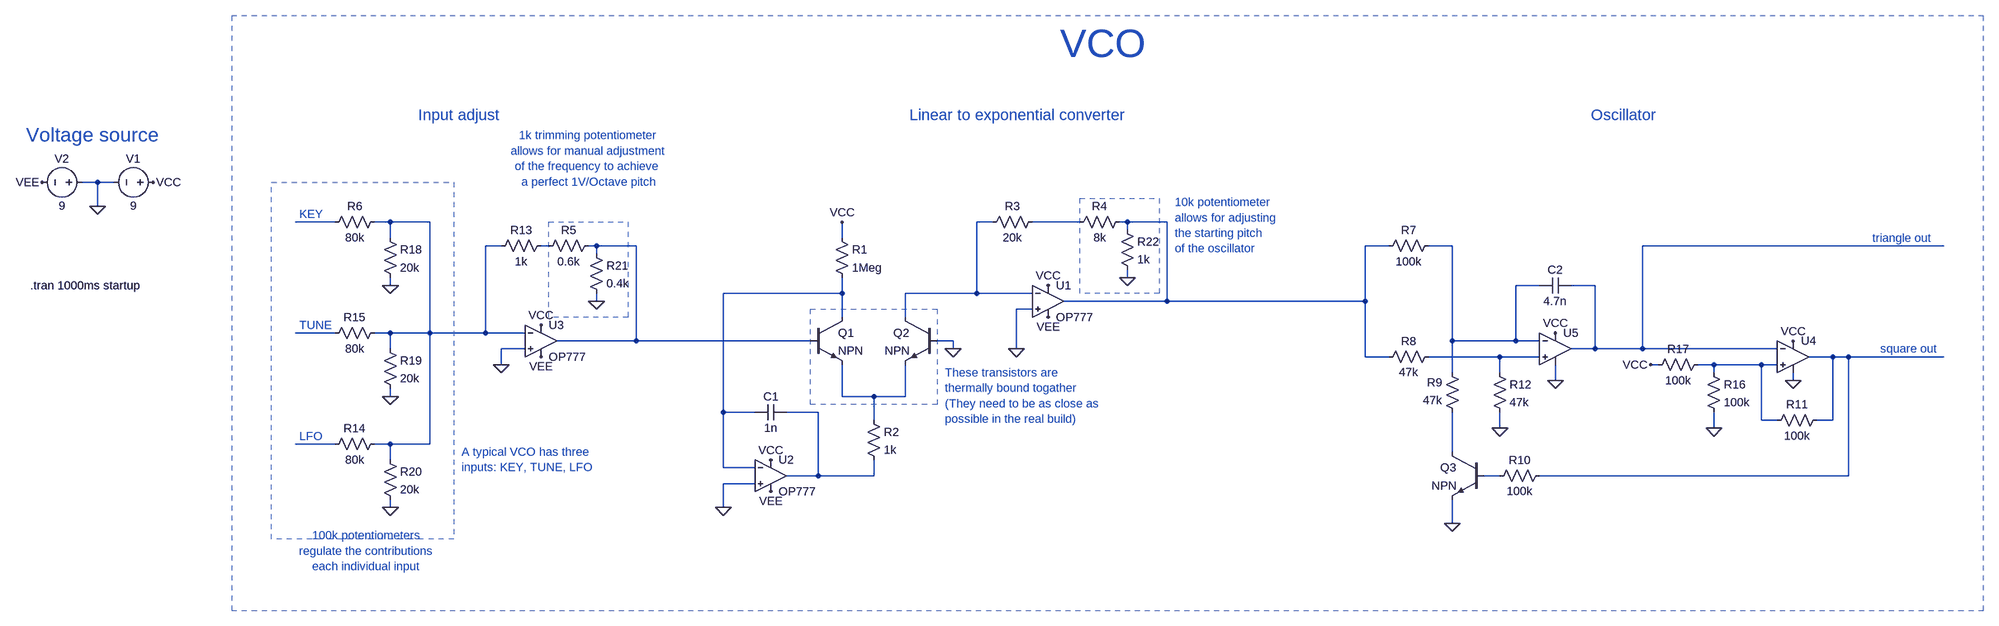
[diagram p0: schematic VCO-simulation.asc]
VCO-simulation.asc, the LTspice schematic file:
Version 4.1
SHEET 1 3220 692
WIRE -976 -176 -1008 -176
WIRE -944 -176 -976 -176
WIRE -976 -128 -976 -176
WIRE -432 -96 -512 -96
WIRE -320 -96 -352 -96
WIRE -240 -96 -320 -96
WIRE 896 -96 864 -96
WIRE 1072 -96 976 -96
WIRE 1168 -96 1152 -96
WIRE 1248 -96 1168 -96
WIRE 1168 -80 1168 -96
WIRE -320 -64 -320 -96
WIRE 592 -64 592 -96
WIRE -96 -48 -128 -48
WIRE 0 -48 -16 -48
WIRE 96 -48 80 -48
WIRE 176 -48 96 -48
WIRE 1696 -48 1648 -48
WIRE 1824 -48 1776 -48
WIRE 2816 -48 2208 -48
WIRE 96 -32 96 -48
WIRE 1168 16 1168 0
WIRE -320 32 -320 16
WIRE 2000 32 1952 32
WIRE 2112 32 2064 32
WIRE 592 48 592 16
WIRE 592 48 352 48
WIRE 864 48 864 -96
WIRE 864 48 720 48
WIRE 976 48 864 48
WIRE 96 64 96 48
WIRE 1248 64 1248 -96
WIRE 1248 64 1040 64
WIRE 1648 64 1648 -48
WIRE 1648 64 1248 64
WIRE 976 80 944 80
WIRE 592 96 592 48
WIRE 720 96 720 48
WIRE -432 128 -512 128
WIRE -320 128 -352 128
WIRE -240 128 -240 -96
WIRE -240 128 -320 128
WIRE -128 128 -128 -48
WIRE -128 128 -240 128
WIRE -48 128 -128 128
WIRE 176 144 176 -48
WIRE 176 144 16 144
WIRE 528 144 176 144
WIRE 816 144 784 144
WIRE 1824 144 1824 -48
WIRE 1952 144 1952 32
WIRE 1952 144 1824 144
WIRE 2000 144 1952 144
WIRE -320 160 -320 128
WIRE -48 160 -96 160
WIRE 816 160 816 144
WIRE 944 160 944 80
WIRE 2112 160 2112 32
WIRE 2112 160 2064 160
WIRE 2208 160 2208 -48
WIRE 2208 160 2112 160
WIRE 2480 160 2208 160
WIRE 1648 176 1648 64
WIRE 1696 176 1648 176
WIRE 1920 176 1776 176
WIRE 2000 176 1920 176
WIRE 2592 176 2544 176
WIRE 2624 176 2592 176
WIRE 2816 176 2624 176
WIRE -96 192 -96 160
WIRE 2240 192 2224 192
WIRE 2352 192 2320 192
WIRE 2448 192 2352 192
WIRE 2480 192 2448 192
WIRE 1824 208 1824 144
WIRE 1920 208 1920 176
WIRE 2352 208 2352 192
WIRE 2032 224 2032 192
WIRE 2512 224 2512 208
WIRE -320 256 -320 240
WIRE 592 256 592 192
WIRE 656 256 592 256
WIRE 720 256 720 192
WIRE 720 256 656 256
WIRE 352 288 352 48
WIRE 416 288 352 288
WIRE 544 288 480 288
WIRE 656 304 656 256
WIRE 2448 304 2448 192
WIRE 2480 304 2448 304
WIRE 2592 304 2592 176
WIRE 2592 304 2560 304
WIRE 1920 320 1920 288
WIRE 2352 320 2352 288
WIRE -432 352 -512 352
WIRE -320 352 -352 352
WIRE -240 352 -240 128
WIRE -240 352 -320 352
WIRE 1824 368 1824 288
WIRE -320 384 -320 352
WIRE 352 400 352 288
WIRE 416 400 352 400
WIRE 544 416 544 288
WIRE 544 416 480 416
WIRE 656 416 656 384
WIRE 656 416 544 416
WIRE 1920 416 1888 416
WIRE 2624 416 2624 176
WIRE 2624 416 2000 416
WIRE 416 432 352 432
WIRE -320 480 -320 464
WIRE 352 480 352 432
WIRE 1824 512 1824 464
FLAG 352 480 0
FLAG 592 -96 VCC
FLAG 1008 32 VCC
FLAG 1008 96 VEE
FLAG 448 384 VCC
FLAG 448 448 VEE
FLAG -96 192 0
FLAG -16 112 VCC
FLAG -16 176 VEE
FLAG 816 160 0
FLAG 944 160 0
FLAG 2512 144 VCC
FLAG 2032 128 VCC
FLAG 1824 512 0
FLAG 2512 224 0
FLAG 2032 224 0
FLAG 1920 320 0
FLAG 2352 320 0
FLAG 2224 192 VCC
FLAG -320 32 0
FLAG -320 256 0
FLAG -320 480 0
FLAG 96 64 0
FLAG 1168 16 0
FLAG -1088 -176 VEE
FLAG -864 -176 VCC
FLAG -976 -128 0
SYMBOL res 576 -80 R0
SYMATTR InstName R1
SYMATTR Value 1Meg
SYMBOL npn 528 96 R0
SYMATTR InstName Q1
SYMBOL npn 784 96 M0
SYMATTR InstName Q2
SYMBOL res 640 288 R0
SYMATTR InstName R2
SYMATTR Value 1k
SYMBOL cap 480 272 R90
WINDOW 0 0 32 VBottom 2
WINDOW 3 32 32 VTop 2
SYMATTR InstName C1
SYMATTR Value 1n
SYMBOL OpAmps\\OP777 1008 0 R0
SYMATTR InstName U1
SYMBOL res 992 -112 R90
WINDOW 0 0 56 VBottom 2
WINDOW 3 32 56 VTop 2
SYMATTR InstName R3
SYMATTR Value 20k
SYMBOL res 1168 -112 R90
WINDOW 0 0 56 VBottom 2
WINDOW 3 32 56 VTop 2
SYMATTR InstName R4
SYMATTR Value 8k
SYMBOL OpAmps\\OP777 448 352 R0
SYMATTR InstName U2
SYMBOL OpAmps\\OP777 -16 80 R0
SYMATTR InstName U3
SYMBOL res 96 -64 R90
WINDOW 0 0 56 VBottom 2
WINDOW 3 32 56 VTop 2
SYMATTR InstName R5
SYMATTR Value 0.6k
SYMBOL res -336 -112 R90
WINDOW 0 0 56 VBottom 2
WINDOW 3 32 56 VTop 2
SYMATTR InstName R6
SYMATTR Value 80k
SYMBOL res 1792 -64 R90
WINDOW 0 0 56 VBottom 2
WINDOW 3 32 56 VTop 2
SYMATTR InstName R7
SYMATTR Value 100k
SYMBOL res 1792 160 R90
WINDOW 0 0 56 VBottom 2
WINDOW 3 32 56 VTop 2
SYMATTR InstName R8
SYMATTR Value 47k
SYMBOL res 1840 304 R180
WINDOW 0 36 76 Left 2
WINDOW 3 36 40 Left 2
SYMATTR InstName R9
SYMATTR Value 47k
SYMBOL res 2016 400 R90
WINDOW 0 0 56 VBottom 2
WINDOW 3 32 56 VTop 2
SYMATTR InstName R10
SYMATTR Value 100k
SYMBOL npn 1888 368 M0
SYMATTR InstName Q3
SYMBOL res 2576 288 R90
WINDOW 0 0 56 VBottom 2
WINDOW 3 32 56 VTop 2
SYMATTR InstName R11
SYMATTR Value 100k
SYMBOL res 1904 192 R0
SYMATTR InstName R12
SYMATTR Value 47k
SYMBOL Opamps\\UniversalOpamp2 2512 176 R0
SYMATTR InstName U4
SYMBOL Opamps\\UniversalOpamp2 2032 160 R0
SYMATTR InstName U5
SYMBOL res 0 -64 R90
WINDOW 0 0 56 VBottom 2
WINDOW 3 32 56 VTop 2
SYMATTR InstName R13
SYMATTR Value 1k
SYMBOL res -336 336 R90
WINDOW 0 0 56 VBottom 2
WINDOW 3 32 56 VTop 2
SYMATTR InstName R14
SYMATTR Value 80k
SYMBOL cap 2064 16 R90
WINDOW 0 0 32 VBottom 2
WINDOW 3 32 32 VTop 2
SYMATTR InstName C2
SYMATTR Value 4.7n
SYMBOL res -336 112 R90
WINDOW 0 0 56 VBottom 2
WINDOW 3 32 56 VTop 2
SYMATTR InstName R15
SYMATTR Value 80k
SYMBOL res 2336 192 R0
SYMATTR InstName R16
SYMATTR Value 100k
SYMBOL res 2336 176 R90
WINDOW 0 0 56 VBottom 2
WINDOW 3 32 56 VTop 2
SYMATTR InstName R17
SYMATTR Value 100k
SYMBOL res -336 -80 R0
SYMATTR InstName R18
SYMATTR Value 20k
SYMBOL res -336 144 R0
SYMATTR InstName R19
SYMATTR Value 20k
SYMBOL res -336 368 R0
SYMATTR InstName R20
SYMATTR Value 20k
SYMBOL res 80 -48 R0
SYMATTR InstName R21
SYMATTR Value 0.4k
SYMBOL res 1152 -96 R0
SYMATTR InstName R22
SYMATTR Value 1k
SYMBOL voltage -848 -176 R90
WINDOW 0 -32 56 VBottom 2
WINDOW 3 32 56 VTop 2
SYMATTR InstName V1
SYMATTR Value 9
SYMBOL voltage -992 -176 R90
WINDOW 0 -32 56 VBottom 2
WINDOW 3 32 56 VTop 2
SYMATTR InstName V2
SYMATTR Value 9
TEXT -264 -312 Left 3 ;Input adjust
TEXT 1264 -136 Left 2 ;10k potentiometer\nallows for adjusting\nthe starting pitch\nof the oscillator
TEXT 728 -312 Left 3 ;Linear to exponential converter
TEXT 2104 -312 Left 3 ;Oscillator
TEXT 80 -224 Center 2 ;1k trimming potentiometer\nallows for manual adjustment\nof the frequency to achieve \na perfect 1V/Octave pitch
TEXT -368 568 Center 2 ;100k potentiometers\nregulate the contributions\neach individual input
TEXT -176 368 Left 2 ;A typical VCO has three\ninputs: KEY, TUNE, LFO
TEXT 1032 -456 Left 6 ;VCO
TEXT 800 208 Left 2 ;These transistors are\nthermally bound togather\n(They need to be as close as\npossible in the real build)
TEXT -504 -112 Left 2 ;KEY
TEXT -504 112 Left 2 ;TUNE
TEXT -504 336 Left 2 ;LFO
TEXT -1112 32 Left 2 !.tran 1000ms startup
TEXT -1120 -272 Left 4 ;Voltage source
TEXT 2672 -64 Left 2 ;triangle out
TEXT 2688 160 Left 2 ;square out
RECTANGLE Normal -192 544 -560 -176 2
RECTANGLE Normal 0 -96 160 96 2
RECTANGLE Normal 2896 -512 -640 688 2
RECTANGLE Normal 784 272 528 80 2
RECTANGLE Normal 1072 -144 1232 48 2

The netlist it stands for:
* VCO-simulation.asc
R1 VCC N010 1Meg
Q1 N010 N007 N015 0 NPN
Q2 N003 0 N015 0 NPN
R2 N015 N016 1k
C1 N016 N010 1n
X§U1 0 N003 VCC VEE N005 OP777  ; pins In+ In- V+ V- OUT
R3 N004 N003 20k
R4 N005 N004 8k
X§U2 0 N010 VCC VEE N016 OP777  ; pins In+ In- V+ V- OUT
X§U3 0 N002 VCC VEE N007 OP777  ; pins In+ In- V+ V- OUT
R5 N007 N006 0.6k
R6 N002 N001 80k
R7 N008 N005 100k
R8 N012 N005 47k
R9 N018 N008 47k
R10 N013 N019 100k
Q3 N018 N019 0 0 NPN
R11 N013 N014 100k
R12 N012 0 47k
X§U4 N014 N009 VCC 0 N013 level.2 Avol=1Meg GBW=10Meg Slew=10Meg ilimit=25m rail=0 Vos=0 phimargin=45 en=0 enk=0 in=0 ink=0 Rin=500Meg  ; pins IN+ IN- V+ V- OUT
X§U5 N012 N008 VCC 0 N009 level.2 Avol=1Meg GBW=10Meg Slew=10Meg ilimit=25m rail=0 Vos=0 phimargin=45 en=0 enk=0 in=0 ink=0 Rin=500Meg  ; pins IN+ IN- V+ V- OUT
R13 N006 N002 1k
R14 N002 N017 80k
C2 N009 N008 4.7n
R15 N002 N011 80k
R16 N014 0 100k
R17 N014 VCC 100k
R18 N002 0 20k
R19 N002 0 20k
R20 N002 0 20k
R21 N007 0 0.4k
R22 N005 0 1k
V1 VCC 0 9
V2 0 VEE 9
.model NPN NPN
.model PNP PNP
.lib standard.bjt
* Input adjust
* 10k potentiometer
* allows for adjusting
* the starting pitch
* of the oscillator
* Linear to exponential converter
* Oscillator
* 1k trimming potentiometer
* allows for manual adjustment
* of the frequency to achieve
* a perfect 1V/Octave pitch
* 100k potentiometers
* regulate the contributions
* each individual input
* A typical VCO has three
* inputs: KEY, TUNE, LFO
* VCO
* These transistors are
* thermally bound togather
* (They need to be as close as
* possible in the real build)
* KEY
* TUNE
* LFO
.tran 1000ms startup
* Voltage source
* triangle out
* square out
.lib ADI.lib
.lib UniversalOpamps2.sub
.backanno
.end